# EAGLE design Tiny PowerSpy (EAGLE 9.6.2)
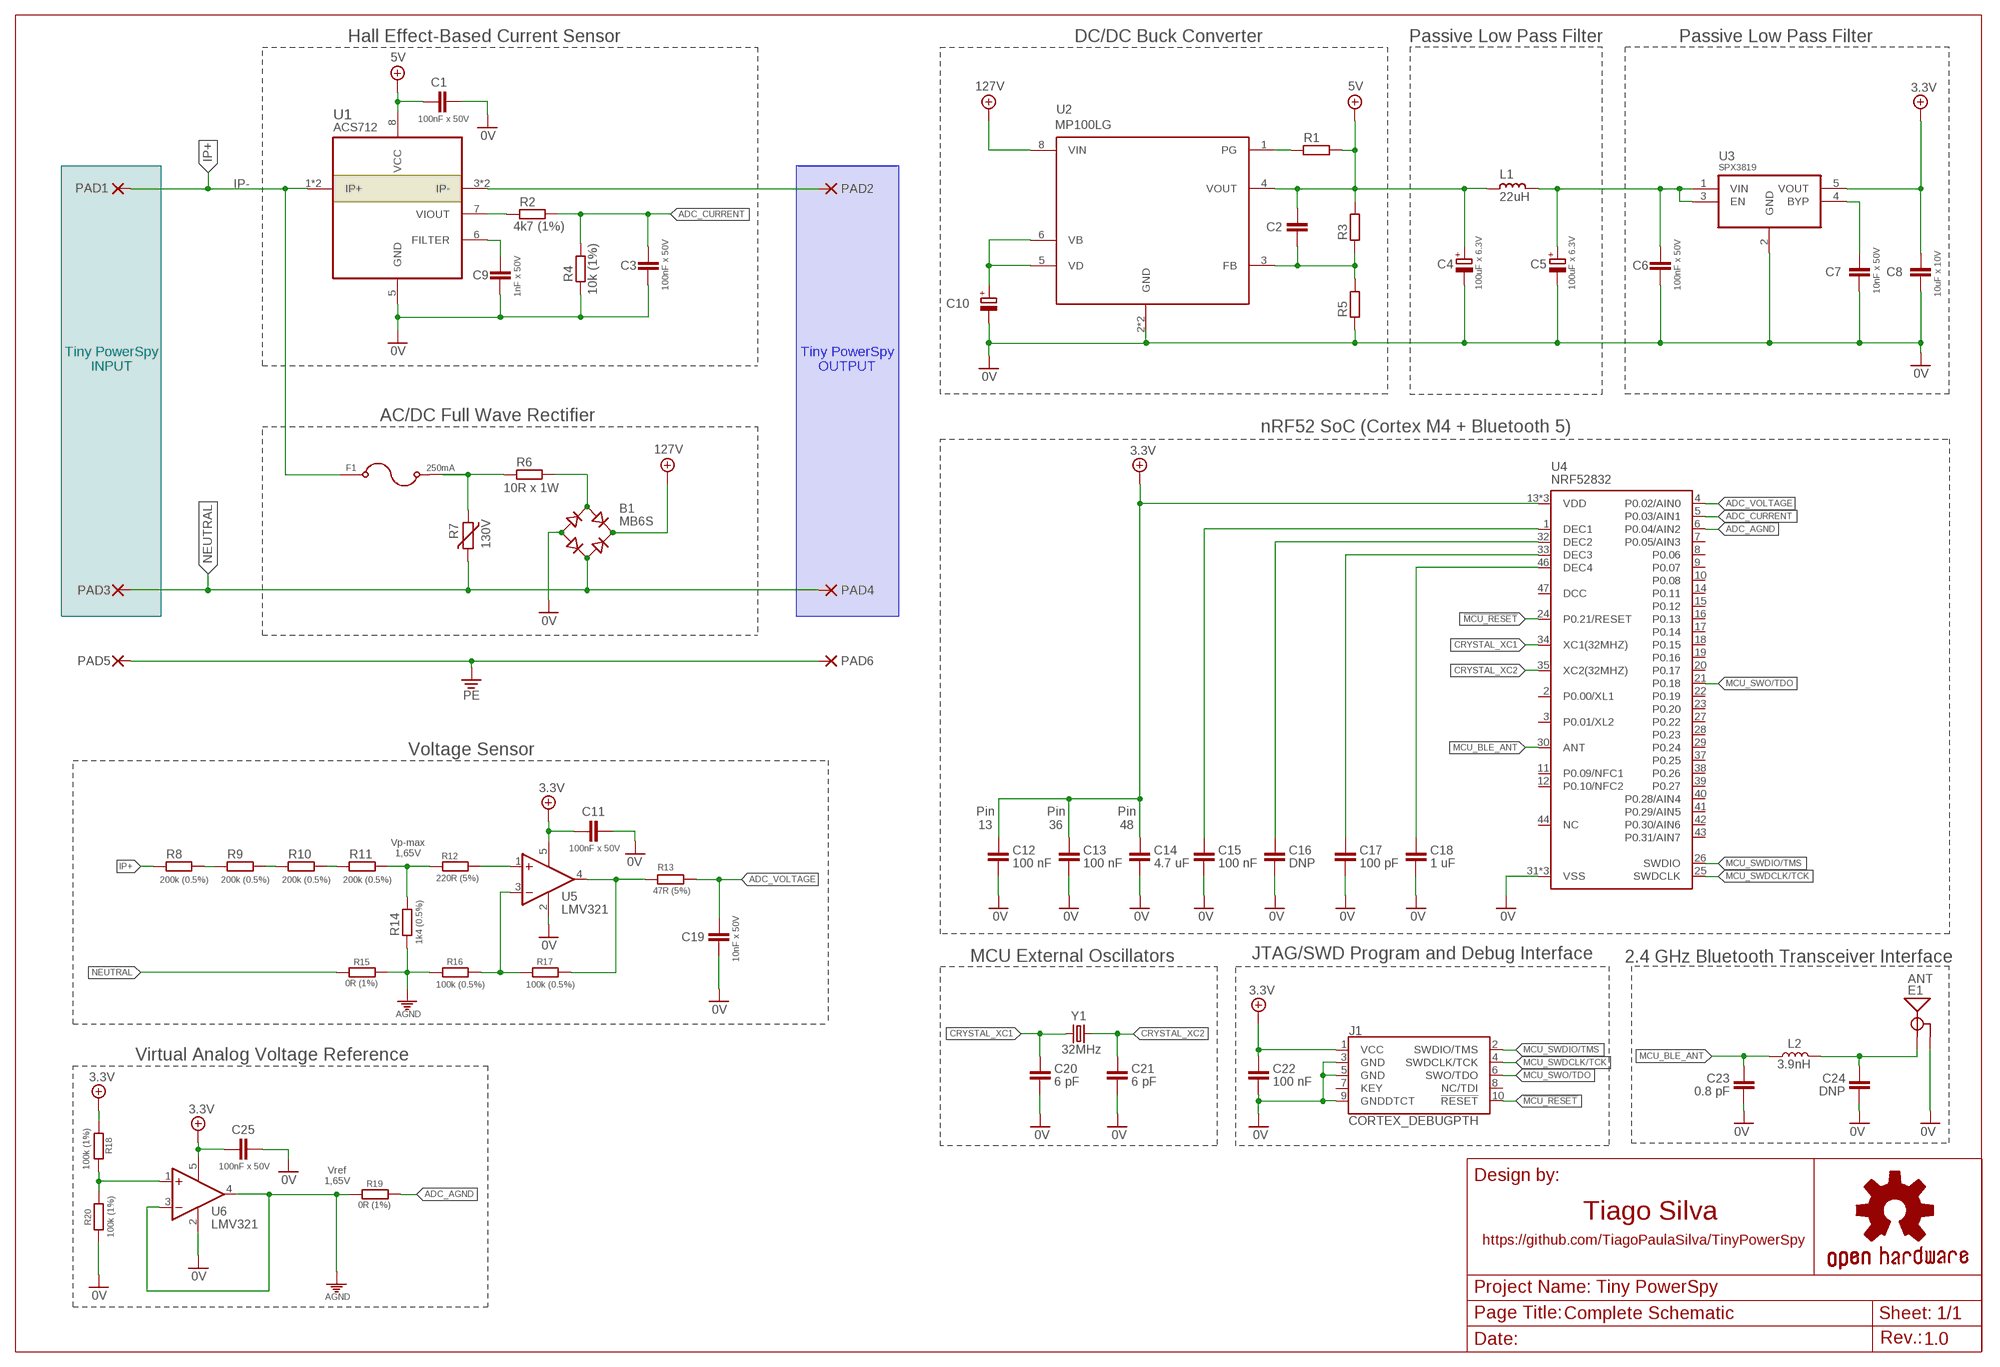
[diagram p0: schematic, sheet 1]

## Parts
B1  MB6S  [SOIC-4]
C1  100nF x 50V  C-EUC0603  [C0603]
C2  C-EUC0603  [C0603]
C3  100nF x 50V  C-EUC0603  [C0603]
C4  100uF x 6.3V  C-USC1206K  [C1206K]
C5  100uF x 6.3V  C-USC1206K  [C1206K]
C6  100nF x 50V  C-EUC0603  [C0603]
C7  10nF x 50V  C-EUC0603  [C0603]
C8  10uF x 10V  C-EUC0603  [C0603]
C9  1nF x 50V  C-EUC0603  [C0603]
C10  CPOL-EUE3.5-8  [E3,5-8]
C11  100nF x 50V  C-EUC0603  [C0603]
C12  100 nF  C-EUC0402  [C0402]
C13  100 nF  C-EUC0402  [C0402]
C14  4.7 uF  C-EUC0603  [C0603]
C15  100 nF  C-EUC0402  [C0402]
C16  DNP  C-EUC0402  [C0402]
C17  100 pF  C-EUC0402  [C0402]
C18  1 uF  C-EUC0603  [C0603]
C19  10nF x 50V  C-EUC0603  [C0603]
C20  6 pF  C-EUC0402  [C0402]
C21  6 pF  C-EUC0402  [C0402]
C22  100 nF  C-EUC0603  [C0603]
C23  0.8 pF  C-EUC0603  [C0603]
C24  DNP  C-EUC0603  [C0603]
C25  100nF x 50V  C-EUC0603  [C0603]
E1  ANT  ANTENNA-GROUNDEDTRACE-15.2MM  [TRACE_ANTENNA_2.4GHZ_15.2MM]
F1  250mA  0154004.DR  [FUSE_0154004.DR]
J1  CORTEX_DEBUGPTH  [2X5-PTH-1.27MM]
L1  22uH  L_0603  [L0603]
L2  3.9nH  INDUCTOR-0402-3.9NH  [0402]
PAD1  SMD5  [SMD2,54-5,08]
PAD2  SMD5  [SMD2,54-5,08]
PAD3  SMD2  [SMD1,27-2,54]
PAD4  SMD5  [SMD2,54-5,08]
PAD5  SMD2  [SMD1,27-2,54]
PAD6  SMD5  [SMD2,54-5,08]
R1  R-EU_R0603  [R0603]
R2  4k7 (1%)  R-EU_R0603  [R0603]
R3  R-EU_R0603  [R0603]
R4  10k (1%)  R-EU_R0603  [R0603]
R5  R-EU_R0603  [R0603]
R6  10R x 1W  R-EU_0207/5V  [0207/5V]
R7  130V  VARISTOR  [S05K11]
R8  200k (0.5%)  R-EU_R0603  [R0603]
R9  200k (0.5%)  R-EU_R0603  [R0603]
R10  200k (0.5%)  R-EU_R0603  [R0603]
R11  200k (0.5%)  R-EU_R0603  [R0603]
R12  220R (5%)  R-EU_R0603  [R0603]
R13  47R (5%)  R-EU_R0603  [R0603]
R14  1k4 (0.5%)  R-EU_R0603  [R0603]
R15  0R (1%)  R-EU_R0603  [R0603]
R16  100k (0.5%)  R-EU_R0603  [R0603]
R17  100k (0.5%)  R-EU_R0603  [R0603]
R18  100k (1%)  R-EU_R0603  [R0603]
R19  0R (1%)  R-EU_R0603  [R0603]
R20  100k (1%)  R-EU_R0603  [R0603]
U1  ACS712  ACS712ELCTR-20A-T  [SOIC127P600X175-8N]
U2  MP100LG  [SOIC8E]
U3  SPX3819  SPX3819M5-L-3-3  [SOT95P280X145-5N]
U4  NRF52832  [QFN48-6X6MM]
U5  LMV321  LMV321M5  [SOT23-5]
U6  LMV321  LMV321M5  [SOT23-5]
Y1  32MHz  CRYSTAL-32MHZ-SMD-2.0X1.6MM  [CRYSTAL-SMD-2.0X1.6MM]

## Nets
0V: B1.- C1.1 C3.2 C4.2 C5.2 C6.2 C7.2 C8.2 C9.2 C10.- C11.1 C12.2 C13.2 C14.2 C15.2 C16.2 C17.2 C18.2 C19.2 C20.2 C21.2 C22.2 C23.2 C24.2 C25.2 E1.GND J1.3(GND) J1.5(GND) J1.9(GNDDTCT) R4.2 R5.1 R20.2 U1.5(GND) U2.2(GND) U2.9(GND) U3.2(GND) U4.31(VSS) U4.45(VSS) U4.EP(VSS) U5.2(V-) U6.2(V-)
3.3V: C8.1 C11.2 C12.1 C13.1 C14.1 C22.1 C25.1 J1.1(VCC) R18.2 U3.5(VOUT) U4.13(VDD) U4.36(VDD) U4.48(VDD) U5.5(V+) U6.5(V+)
5V: C1.2 C2.1 C4.1 L1.2 R1.2 R3.2 U1.8(VCC) U2.4(VOUT)
127V: B1.+ U2.8(VIN)
!MCU_RESET!: J1.10(!RESET) U4.24(P0.21/RESET)
ADC_AGND: R19.2 U4.6(P0.04/AIN2)
ADC_CURRENT: C3.1 R2.2 R4.1 U4.5(P0.03/AIN1)
ADC_VOLTAGE: C19.1 R13.1 U4.4(P0.02/AIN0)
AGND: R14.2 R15.2 R16.2 R19.1 U6.3(-IN) U6.4(OUT)
CRYSTAL_XC1: C20.1 U4.34(XC1(32MHZ)) Y1.3
CRYSTAL_XC2: C21.1 U4.35(XC2(32MHZ)) Y1.1
IP+: F1.1 PAD1.1(P) R8.1 U1.1(IP+) U1.2(IP+)
IP-: PAD2.1(P) U1.3(IP-) U1.4(IP-)
MCU_BLE_ANT: C23.1 L2.2 U4.30(ANT)
MCU_SWDCLK/TCK: J1.4(SWDCLK/TCK) U4.25(SWDCLK)
MCU_SWDIO/TMS: J1.2(SWDIO/TMS) U4.26(SWDIO)
MCU_SWO/TDO: J1.6(SWO/TDO) U4.21(P0.18)
N$1: R1.1 U2.1(PG)
N$2: F1.2 R6.1 R7.1
N$3: C16.1 U4.32(DEC2)
N$4: C2.2 R3.1 R5.2 U2.3(FB)
N$5: C10.+ U2.5(VD) U2.6(VB)
N$6: C9.1 U1.6(FILTER)
N$7: B1.~1(AC1) R6.2
N$8: C15.1 U4.1(DEC1)
N$9: C18.1 U4.46(DEC4)
N$10: R2.1 U1.7(VIOUT)
N$11: C24.1 E1.ANT(SIGNAL) L2.1
N$12: R9.2 R10.1
N$13: C17.1 U4.33(DEC3)
N$14: R10.2 R11.1
N$15: R13.2 R17.1 U5.4(OUT)
N$16: C5.1 C6.1 L1.1 U3.1(VIN) U3.3(EN)
N$19: R8.2 R9.1
N$20: C7.1 U3.4(BYP)
N$30: R16.1 R17.2 U5.3(-IN)
N$31: R11.2 R12.2 R14.1
N$32: R12.1 U5.1(+IN)
N$76: R18.1 R20.1 U6.1(+IN)
NEUTRAL: B1.~2(AC2) PAD3.1(P) PAD4.1(P) R7.2 R15.1
PE: PAD5.1(P) PAD6.1(P)
Unconnected: J1.7(KEY) J1.8(NC/TDI) U4.2(P0.00/XL1) U4.3(P0.01/XL2) U4.7(P0.05/AIN3) U4.8(P0.06) U4.9(P0.07) U4.10(P0.08) U4.11(P0.09/NFC1) U4.12(P0.10/NFC2) U4.14(P0.11) U4.15(P0.12) U4.16(P0.13) U4.17(P0.14) U4.18(P0.15) U4.19(P0.16) U4.20(P0.17) U4.22(P0.19) U4.23(P0.20) U4.27(P0.22) U4.28(P0.23) U4.29(P0.24) U4.37(P0.25) U4.38(P0.26) U4.39(P0.27) U4.40(P0.28/AIN4) U4.41(P0.29/AIN5) U4.42(P0.30/AIN6) U4.43(P0.31/AIN7) U4.44(NC) U4.47(DCC)

## Notes on the sheet
- Hall Effect-Based Current Sensor | DC/DC Buck Converter | Passive Low Pass Filter | Passive Low Pass Filter
- Tiny PowerSpy
  INPUT
- Tiny PowerSpy
  OUTPUT
- AC/DC Full Wave Rectifier
- nRF52 SoC (Cortex M4 + Bluetooth 5)
- Voltage Sensor
- Pin
  13
- Pin
  36
- Pin
  48
- Vp-max
  1,65V
- MCU External Oscillators | JTAG/SWD Program and Debug Interface | 2.4 GHz Bluetooth Transceiver Interface
- Virtual Analog Voltage Reference
- Vref
  1,65V
- Tiago Silva
- https://github.com/TiagoPaulaSilva/TinyPowerSpy
- Complete Schematic
- 1.0

## Library data of the parts
B1 = rectifier:MB*S: Bridge Rectifier Source: http://www.fairchildsemi.com/ds/MB/MB6S.pdf
C1 C3 C6 C9 C11 C25 = rcl:C-EU: CAPACITOR, European symbol; PN: C0603C104M5RACTU; SPICEPREFIX: C
C2 C12-C18 C20-C24 = rcl:C-EU: CAPACITOR, European symbol; SPICEPREFIX: C
C4 C5 = rcl:C-US: CAPACITOR, American symbol; SPICEPREFIX: C
C7 C19 = rcl:C-EU: CAPACITOR, European symbol; PN: C0603C103M5RACTU; SPICEPREFIX: C
C8 = rcl:C-EU: CAPACITOR, European symbol; PN: GRM188R61A106ME69D; SPICEPREFIX: C
C10 = rcl:CPOL-EU: POLARIZED CAPACITOR, European symbol; SPICEPREFIX: C
E1 = SparkFun-RF:ANTENNA-GROUNDED: Antenna w/ Ground Connection 2.4GHz antennae with signal and ground terminals. TRACE_ANTENNA_2.4GHZ_15.2MM - Meander Trace antenna 15.2 x 5.7mm footprint Based on layout from TI app note AN043 <http://www.ti.com/lit/an/swra117d/swra117d.pdf>. TRACE_ANTENNA_2.4GHZ_25.7MM - Inverted F trace antenna 25.7 x 7.5 mm footprint. Based on layout from TI design note DN0007 <http://www.ti.com/lit/an/swru120b/swru120b.pdf>.
F1 = Fuse SMD:0154004.DR: 154/154T/154L/154TL Series OMNI-BLOK® Fuse and Holder Assembly; DESCRIPTION: 4A 125V AC 125V DC Fuse Board Mount (Cartridge Style Excluded) Holder, Surface Mount 2-SMD, Square End Block with Holder; DIGI-KEY_PART_NUMBER: F1227CT-ND; MF: Littelfuse Inc.; MP: 0154004.DR; PACKAGE: SMD-2 Littelfuse
J1 = SparkFun-Connectors:CORTEX_DEBUG: Cortex Debug Connector Datasheet <http://infocenter.arm.com/help/topic/com.arm.doc.faqs/attached/13634/cortex_debug_connectors.pdf>
L1 = rc-master-smd:L_: INDUCTOR
L2 = nrf52832-breakout-temp:INDUCTOR: Inductors Resist changes in electrical current. Basically a coil of wire. SparkFun Products: SparkFun Load Cell Amplifier - HX711 <https://www.sparkfun.com/products/13879> IOIO-OTG - V2.2 <https://www.sparkfun.com/products/13613>; PROD_ID: NDUC-13457
PAD1 PAD2 PAD4 PAD6 = Wirepad:SMD5: SMD PAD
PAD3 PAD5 = Wirepad:SMD2: SMD PAD
R1-R5 = rcl:R-EU_: RESISTOR, European symbol; SPICEPREFIX: R
R6 = resistor pot:R-EU_: RESISTOR, European symbol; PN: AC01000008208JACCS; SPICEPREFIX: R
R7 = varistor:VARISTOR
R8-R11 = rcl:R-EU_: RESISTOR, European symbol; PN: RC0603DR-07200KL; SPICEPREFIX: R
R12 = rcl:R-EU_: RESISTOR, European symbol; PN: RC0603JR-07220RL; SPICEPREFIX: R
R13 = rcl:R-EU_: RESISTOR, European symbol; PN: RC0603JR-0747RL; SPICEPREFIX: R
R14 = rcl:R-EU_: RESISTOR, European symbol; PN: ERJ-3RBD1401V; SPICEPREFIX: R
R15 R19 = rcl:R-EU_: RESISTOR, European symbol; PN: AC0603FR-070RL; SPICEPREFIX: R
R16-R18 R20 = rcl:R-EU_: RESISTOR, European symbol; PN: ERJ-3RBD104V; SPICEPREFIX: R
U1 = ACS712:ACS712ELCTR-20A-T; AVAILABILITY: Unavailable; DESCRIPTION: Current Sensor 20A 1 Channel Hall Effect, Open Loop Bidirectional 8-SOIC (0.154, 3.90mm Width); MF: Allegro; MP: ACS712ELCTR-20A-T; PACKAGE: SOIC-8 Allegro MicroSystems LLC; PRICE: None
U2 = MP100LGN-P:MP100LG
U3 = SPX3819M5-L-3-3:SPX3819M5-L-3-3: 500mA, LOW-NOISE LDO VOLTAGE REGULATOR; AVAILABILITY: Unavailable; DESCRIPTION: Linear Voltage Regulator IC 1 Output 500mA SOT-23-5; MF: MaxLinear, Inc.; MP: SPX3819M5-L-3-3; PACKAGE: SOT-23-5 Exar; PN: SPX3819M5-L-3-3/TR; PRICE: None
U4 = nrf52832-breakout-temp:NRF52832: Nordic nRF52832 Bluetooth Smart/ANT/2.4GHz RF SoC The nRF52832 SoC is a powerful, highly flexible ultra-low power multiprotocol SoC ideally suited for Bluetooth® Smart ANT and 2.4GHz ultra low-power wireless applications. The nRF52832 SoC is built around a 32-bit ARM® Cortex™-M4F CPU with 512kB + 64kB RAM. The embedded 2.4GHz transceiver supports Bluetooth Smart, ANT and proprietary 2.4 GHz protocol stack. It is on air compatible with the nRF51 Series, nRF24L and nRF24AP Series products from Nordic Semiconductor. Product Page <https://www.nordicsemi.com/eng/Products/Bluetooth-low-energy2/nRF52832>; PROD_ID: IC-13460
U5 U6 = linear:LMV321?*: General Purpose, Low Voltage, Rail-to-Rail Output Operational Amplifiers Source: http://www.national.com/mpf/LM/LMV321.html http://www.national.com/dt/lmv_qual.pdf
Y1 = nrf52832-breakout-temp:CRYSTAL-32MHZ: 32MHz Crystal Digikey Example <http://www.digikey.com/product-detail/en/murata-electronics-north-america/XRCGB32M000F2P00R0/490-9769-1-ND/4952013> Frequency: 32MHz Frequency Stability: ±20ppm Frequency Tolerance: ±20ppm Load Capacitance: 6pF; PROD_ID: XTAL-13459

## Board
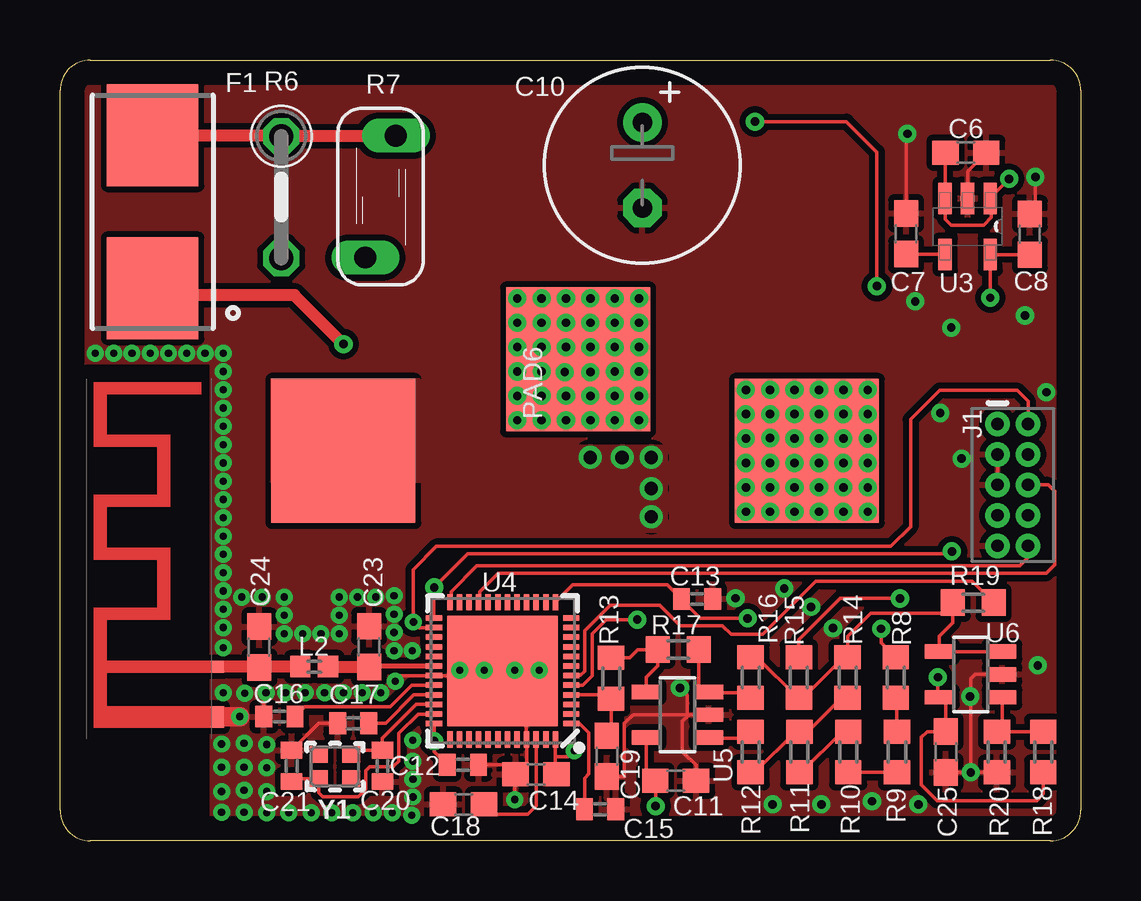
[diagram p1: board, top side]
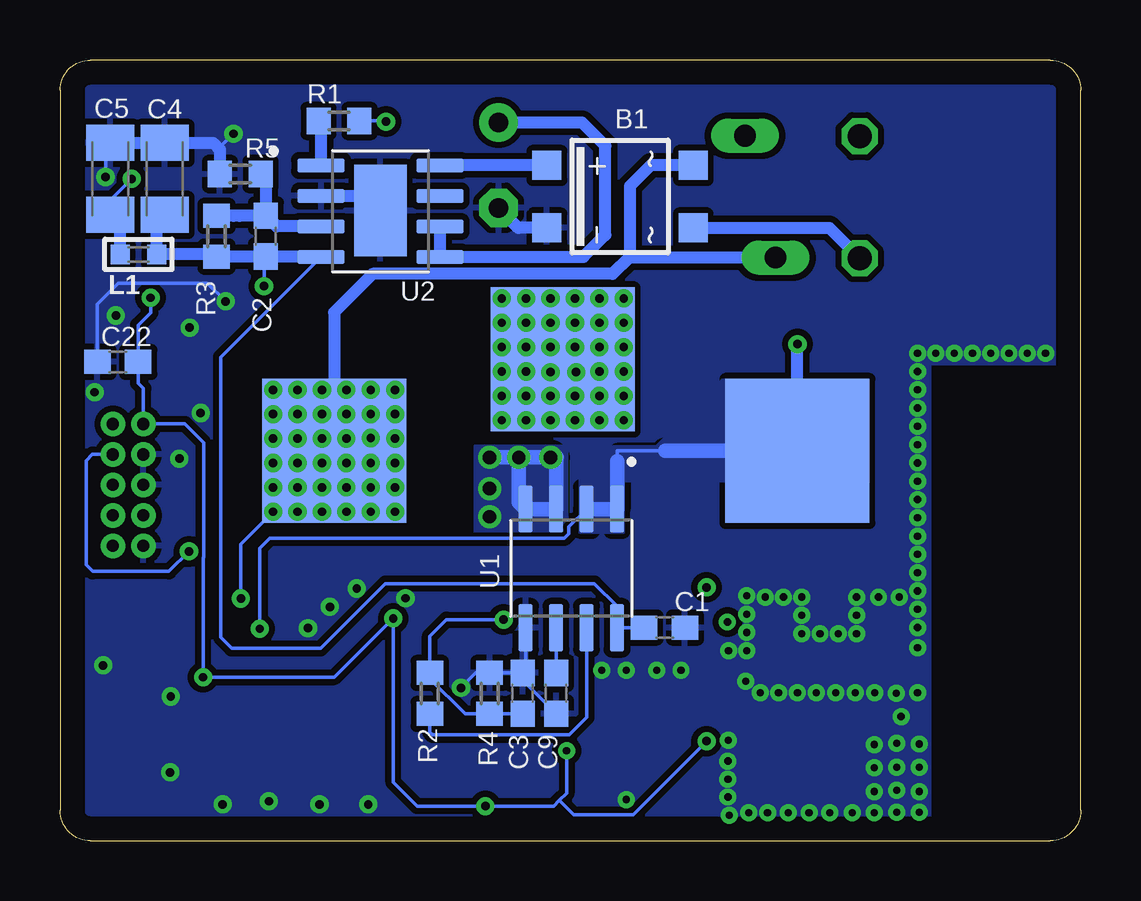
[diagram p2: board, bottom side, seen from below]

Size 42.54 x 32.54 mm. Coordinates in mm from the lower left corner, seen from the top.
Outline: 41.27,0 arc90 42.54,1.27 42.54,31.27 arc90 41.27,32.54 1.27,32.54 arc90 0,31.27 0,1.27 arc90 1.27,0 41.27,0
Copper layers (1*16): Top 0.035mm / dielectric 1.5mm / Bottom 0.035mm
Design rules "default *": minimum track width 6mil, minimum drill 0.3mm, track to track 6mil, track to pad 6mil, pad to pad 6mil, via to via 6mil, smd to smd 6mil, copper to edge 40mil, drill to drill 6mil, minimum pad ring 10mil, minimum via ring 8mil, stop-mask expansion 4mil, vias tented up to drill 14mil, thermal gap 10mil

### Footprints (pad centres in the part's own frame; a part is rotated, then mirrored left to right if it is on the bottom)
SOIC-4 = smd 1.2 x 1.2: + 1.3,3.05; - -1.3,3.05; ~1 -1.3,-3.05; ~2 1.3,-3.05
C0603 = smd 1.1 x 1: 1 -0.85,0; 2 0.85,0
C1206K = smd 1.5 x 2: 1 -1.5,0; 2 1.5,0
E3,5-8 = drill 0.813 pad 1.6: + -1.778,0 | drill 0.813 pad 1.6 octagon: - 1.778,0
C0402 = smd 0.7 x 0.9: 1 -0.65,0; 2 0.65,0
TRACE_ANTENNA_2.4GHZ_15.2MM = smd 0.5 x 0.5: ANT 0,-0.25 | smd 0.9 x 0.5: GND -2.1,-0.25
FUSE_0154004.DR = smd 4.24 x 3.81: 1 -3.19,0; 2 3.19,0
2X5-PTH-1.27MM = drill 0.508 pad 1: 1 -2.54,-0.635; 2 -2.54,0.635; 3 -1.27,-0.635; 4 -1.27,0.635; 5 0,-0.635; 6 0,0.635; 7 1.27,-0.635; 8 1.27,0.635; 9 2.54,-0.635; 10 2.54,0.635
L0603 = smd 0.8 x 0.8: 1 -0.762,0; 2 0.762,0
0402 = smd 0.85 x 0.9: 1 -0.58,0; 2 0.58,0
SMD2,54-5,08 = smd 6 x 6: 1 0,0
SMD1,27-2,54 = smd 6 x 6: 1 0,0
R0603 = smd 1 x 1.1: 1 -0.85,0; 2 0.85,0
0207/5V = drill 1 octagon: 1 -2.54,0; 2 2.54,0
S05K11 = drill 0.914 long: 1 -0.635,-2.54; 2 0.635,2.54
SOIC127P600X175-8N = smd 1.97 x 0.6: 1 -2.475,1.905; 2 -2.475,0.635; 3 -2.475,-0.635; 4 -2.475,-1.905; 5 2.475,-1.905; 6 2.475,-0.635; 7 2.475,0.635; 8 2.475,1.905
SOIC8E = smd 1.97 x 0.6: 1 -2.475,1.905; 2 -2.475,0.635; 3 -2.475,-0.635; 4 -2.475,-1.905; 5 2.475,-1.905; 6 2.475,-0.635; 7 2.475,0.635; 8 2.475,1.905 | smd 2.2 x 3.8: 9 0,0.025
SOT95P280X145-5N = smd 1.321 x 0.559: 1 -1.168,0.94; 2 -1.168,0; 3 -1.168,-0.94; 4 1.168,-0.94; 5 1.168,0.94
QFN48-6X6MM = smd 0.68 x 0.23: 1 -2.86,2.2; 2 -2.86,1.8; 3 -2.86,1.4; 4 -2.86,1; 5 -2.86,0.6; 6 -2.86,0.2; 7 -2.86,-0.2; 8 -2.86,-0.6; 9 -2.86,-1; 10 -2.86,-1.4; 11 -2.86,-1.8; 12 -2.86,-2.2; 25 2.86,-2.2; 26 2.86,-1.8; 27 2.86,-1.4; 28 2.86,-1; 29 2.86,-0.6; 30 2.86,-0.2; 31 2.86,0.2; 32 2.86,0.6; 33 2.86,1; 34 2.86,1.4; 35 2.86,1.8; 36 2.86,2.2 | smd 0.23 x 0.68: 13 -2.2,-2.86; 14 -1.8,-2.86; 15 -1.4,-2.86; 16 -1,-2.86; 17 -0.6,-2.86; 18 -0.2,-2.86; 19 0.2,-2.86; 20 0.6,-2.86; 21 1,-2.86; 22 1.4,-2.86; 23 1.8,-2.86; 24 2.2,-2.86; 37 2.2,2.86; 38 1.8,2.86; 39 1.4,2.86; 40 1,2.86; 41 0.6,2.86; 42 0.2,2.86; 43 -0.2,2.86; 44 -0.6,2.86; 45 -1,2.86; 46 -1.4,2.86; 47 -1.8,2.86; 48 -2.2,2.86 | smd 4.6 x 4.6: EP 0,0
SOT23-5 = smd 0.6 x 1.2: 1 -0.95,-1.306; 2 0,-1.306; 3 0.95,-1.306; 4 0.95,1.306; 5 -0.95,1.306
CRYSTAL-SMD-2.0X1.6MM = smd 0.75 x 0.7: 1 -0.675,-0.5; 2 0.675,-0.5; 3 0.675,0.5; 4 -0.675,0.5

### Placement (x,y rotation side)
B1  19.2,26.85 90 bottom
C1  17.35,8.89 180 bottom
C2  33.96,25.2 90 bottom
C3  23.27,6.15 90 bottom
C4  38.18,27.58 90 bottom
C5  40.44,27.58 90 bottom
C6  37.74,28.68 0 top
C7  35.26,25.3 90 top
C8  40.41,25.27 90 top
C9  21.87,6.15 270 bottom
C10  24.26,28.15 270 top
C11  25.65,2.51 180 top
C12  16.79,3.17 0 top
C13  26.54,10.08 0 top
C14  19.84,2.77 180 top
C15  22.5,1.32 0 top
C16  9.14,5.18 180 top
C17  12.22,4.9 180 top
C18  16.81,1.52 180 top
C19  22.78,3.53 270 top
C20  13.44,3.12 270 top
C21  9.65,3.12 90 top
C22  40.13,19.96 180 bottom
C23  12.88,8.09 90 top
C24  8.31,8.08 90 top
C25  36.91,3.71 270 top
E1  6.32,7.26 90 top
F1  3.86,26.21 90 top
J1  39.7,14.83 270 top
L1  39.27,24.43 0 bottom
L2  10.59,7.26 0 top
PAD1  11.81,16.26 0 bottom
PAD2  11.81,16.26 0 top
PAD3  31.11,16.26 0 bottom
PAD4  31.11,16.26 0 top
PAD5  21.59,20.07 0 bottom
PAD6  21.59,20.07 0 top
R1  30.91,30 0 bottom
R2  27.13,6.15 90 bottom
R3  36.02,25.2 270 bottom
R4  24.64,6.15 90 bottom
R5  35.03,27.79 0 bottom
R6  9.22,26.82 270 top
R7  13.36,26.85 180 top
R8  34.82,6.81 270 top
R9  34.87,3.71 270 top
R10  32.84,3.71 90 top
R11  30.81,3.71 90 top
R12  28.78,3.71 270 top
R13  22.96,6.78 90 top
R14  32.82,6.81 90 top
R15  30.78,6.81 270 top
R16  28.78,6.81 90 top
R17  25.76,7.98 0 top
R18  40.97,3.71 270 top
R19  38.05,9.93 0 top
R20  39.04,3.71 270 top
U1  21.23,11.35 270 bottom
U2  29.18,26.24 0 bottom
U3  37.82,25.6 270 top
U4  18.44,7.09 180 top
U5  25.73,5.26 90 top
U6  37.95,6.93 90 top
Y1  11.46,3.1 0 top

### Tracks (layer width: path | path; a pad name or v marks a point on that pad's centre or on a via)
0V  (via drill 0.3 pad 0.6, 0.35)
  Top 0.152: C11.1 26.5,3.15 25.93,3.72 25.93,4.98 26.21,5.26 U5.2 26.14,5.26 | 26.14,5.26 23.88,5.26 23.52,4.9 23.52,2.69 23.51,2.68 C19.2 | C14.2 18.58,3.17 C12.2 | C14.2 19.44,3.22 U4.45 19.43,5.96 18.44,6.95 U4.EP 18.16,6.81 17.35,6.81 17.27,6.89 U4.31 14.2,6.89 v13.97,6.66 | C17.2 10.78,4.9 C21.2 | C16.2 8.49,6.08 v8.59,6.17 | v25.83,6.38 26.14,6.07 26.14,5.26 | U3.2 37.82,27.9 C6.2 | C8.2 40.42,26.12 40.64,26.34 v40.64,27.66 40.64,25.9 | C7.2 35.26,29.41 v35.31,29.46 | v37.95,2.86 R20.2 | U6.2 38.12,6.93 37.95,6.76 v37.95,2.86 | C25.2 v37.95,2.86 | J1.3 J1.5 | C14.2 18.95,2.73 v18.95,1.72
  Top 0.813: E1.GND 6.59,5.18 v7.49,5.18
  Bottom 0.152: C3.2 R4.2 25.21,7 v25.83,6.38 | U1.5 23.14,7.12 C3.2 | 21.74,5.17 C9.2 23.27,6.69 C3.2 | C5.2 40.64,28.88 v40.64,27.66 | v35.31,29.46 35.88,28.89 R5.1 | C22.2 40.98,22.37 40.11,23.24 36.4,23.24 v35.64,22.48
  Bottom 0.508: B1.- 23.43,25.55 C10.- | C5.2 C4.2 36.16,29.08 35.88,28.8 R5.1 | U2.2 29.16,26.87 28.96,26.67 28.96,26.49 U2.9
  other vias: 1.47,20.32 2.24,20.32 3,20.32 3.76,20.32 4.52,20.32 5.28,20.32 6.05,20.32 6.81,20.32 6.81,19.56 6.81,18.8 6.81,18.03 6.81,17.27 6.81,16.51 6.81,15.75 6.81,14.99 6.81,14.22 6.81,13.46 6.81,12.7 6.81,11.94 6.81,11.18 6.81,10.41 6.81,9.65 6.81,8.89 6.81,8.05 6.73,3.07 6.73,4.04 8.61,4.01 7.67,3.07 7.67,2.11 9.53,1.17 7.67,1.19 8.61,3.05 8.61,2.06 8.61,1.17 11.33,1.17 12.19,1.17 13.06,1.17 13.84,1.17 7.57,10.16 8.43,10.16 9.35,10.16 9.35,9.4 9.35,8.64 10.11,8.64 10.87,8.64 11.63,8.64 11.63,9.4 11.63,10.16 12.4,10.16 13.16,10.16 14.68,7.92 13.92,7.92 13.92,8.69 13.92,9.45 13.92,10.21 14.71,1.83 14.71,2.57 14.71,3.33 7.7,6.15 6.81,6.17 9.4,6.17 10.21,6.17 11.02,6.17 11.81,6.17 12.6,6.17 13.36,6.17 14.7,4.19 6.73,1.19 6.73,2.06 7.67,4.06 14.66,1.07 10.46,1.17 18.95,7.11 17.68,7.11 16.66,7.11 19.96,7.11 40.21,21.89 28.14,10.11 37.13,21.39 37.57,15.93 36.68,17.83 41.1,18.69 40.74,7.32 37.92,6.02 35.76,1.52 32.21,8.86 31.29,9.75 30.18,10.52 33.83,1.65 31.72,1.52 29.69,1.52
  pour Top (isolate 0.254): 0.03,19.91 6.3,19.91 6.3,-0.03 42.52,-0.03 42.52,32.46 0.03,32.46
  pour Bottom (isolate 0.254): 0.03,19.89 6.3,19.89 6.3,-0.03 42.52,-0.03 42.52,32.46 0.03,32.46
3.3V  (via drill 0.3 pad 0.6, 0.35)
  Top 0.152: U5.5 24.42,2.89 C11.2 24.82,2.5 v24.82,1.45 | U4.36 15.6,4.87 v15.6,4.16 15.6,3.72 C12.1 | U4.48 20.64,3.5 | 20.64,3.5 20.64,2.82 C14.1 | v38.76,22.63 38.76,24.41 | 38.76,24.41 U3.5 | R18.2 40.97,1.96 40.69,1.68 36.55,1.68 35.89,2.34 35.89,4.32 36.13,4.56 C25.1 36.91,5.72 U6.5 36.58,6.05 v36.58,6.82 | 20.64,3.5 21.18,3.5 v21.43,3.76 | v28.65,9.27 v28.64,9.28 26.67,9.28 C13.1 25.31,10.67 21.36,10.67 U4.13 | C8.1 38.77,24.42 38.76,24.41
  Bottom 0.152: C22.1 39.28,21.49 38.76,22.01 v38.76,22.63 | 39.1,19.79 39.1,19.68 39.28,19.86 C22.1 | v21.43,3.76 21.43,1.98 21.73,1.69 | 21.73,1.69 21.96,1.45 v24.82,1.45 27.66,1.45 28.65,2.44 v28.65,9.27 31.1,6.82 v36.58,6.82 36.58,11.79 36.55,11.81 36.55,16.59 37.34,17.37 J1.1 39.06,18.86 39.28,19.07 C22.1 | v15.6,4.16 18.66,1.09 21.13,1.09 21.73,1.69
5V  (via drill 0.35)
  Top 0.152: v28.96,29.97 32.77,29.97 34.04,28.7 v34.04,23.11
  Bottom 0.152: C1.2 19.32,8.89 | 19.32,8.89 U1.8 | R1.2 28.98,30 v28.96,29.97 | v34.04,23.11 34.04,24.27 C2.1 | U2.4 35.84,20.15 35.84,8.48 35.38,8.03 31.67,8.03 28.98,10.72 20.27,10.72 19.32,9.77 19.32,8.89
  Bottom 0.508: U2.4 31.67,24.35 C2.1 R3.2 36.1,24.43 L1.2 38.53,24.46 38.53,25.73 C4.1
127V
  Bottom 0.508: B1.+ U2.8
!MCU_RESET!
  Top 0.152: U4.24 16.3,10 16.3,10.38 17.37,11.46 39.98,11.46 40.34,11.81 J1.10
ADC_AGND
  Top 0.152: U4.6 21.68,6.89 21.87,7.08 21.87,8.76 22.93,9.83 25,9.83 25.85,8.97 27.6,8.97 27.96,8.61 29.29,8.61 31.49,10.81 38.02,10.81 R19.2
ADC_CURRENT  (via drill 0.35)
  Top 0.152: U4.5 21.78,6.49 22.05,6.76 22.1,6.81 22.17,6.88 22.17,8.64 22.76,9.22 v24.05,9.22
  Bottom 0.152: 23.37,5.2 C3.1 R4.1 25.66,5.3 27.13,6.76 R2.2 27.13,8.53 26.44,9.22 v24.05,9.22
ADC_VOLTAGE
  Top 0.152: U4.4 22.81,6.09 R13.1 22.96,4.56 C19.1
AGND
  Top 0.152: R16.2 29.03,7.66 30.73,5.96 R15.2 30.96,5.96 32.66,7.66 R14.2 32.82,8.53 33.78,9.49 36.76,9.49 R19.1 37.2,9.09 36.64,8.54 U6.4 U6.3
CRYSTAL_XC1
  Top 0.152: U4.34 14.85,5.69 13.44,4.27 C20.1 12.31,3.77 Y1.3
CRYSTAL_XC2
  Top 0.152: C21.1 9.78,2.6 Y1.1 10.78,2.01 10.94,1.84 12.43,1.84 12.73,2.15 12.73,2.93 12.9,3.1 13.89,3.1 13.89,3.11 14.12,3.33 14.12,4.48 14.92,5.29 U4.35
IP+  (via drill 0.35)
  Top 0.152: v34.21,8.84 34.21,8.27 R8.1
  Top 0.508: v11.81,20.7 9.77,22.74 4.14,22.74 F1.1
  Bottom 0.152: 17.32,16.26 19.33,16.26 19.33,15.82 | U1.2 21.34,13.09 21.34,12.79 21.52,12.62 33.79,12.62 34.21,12.19 v34.21,8.84
  Bottom 0.508: PAD1.1 v11.81,20.7
  Bottom 0.61: 19.33,15.82 U1.1 U1.2 | 17.32,16.26 14.38,16.26
  pour Bottom (no thermals): 19.05,14.96 19.05,12.83 20.88,12.83 20.88,16.46 17.7,16.46 14.94,19.23 8.84,19.23 8.84,14.96
IP-  (via drill 0.55)
  Bottom 0.61: v23.42,15.98 23.42,14.11 U1.4 U1.3 21.87,15.95 21.84,15.98 v22.1,15.98 v23.42,15.98 | v24.64,15.98 v23.42,15.98
  other vias: 24.64,14.68 24.64,13.51
  pour Bottom (no thermals): 21.39,12.88 21.39,16.46 25.27,16.46 25.27,12.88
  pour Top (no thermals): 21.39,14.96 21.39,12.88 25.3,12.88 25.3,16.46 17.75,16.46 14.99,19.23 8.79,19.23 8.79,14.96
MCU_BLE_ANT
  Top 0.203: U4.30 12.92,7.29 arc90 C23.1
  Top 0.5: C23.1 11.19,7.24 L2.2
MCU_SWDCLK/TCK  (via drill 0.35)
  Top 0.152: U4.25 15.58,10.55 v15.6,10.57 16.99,11.96 37.06,11.96 v37.16,12.06
  Bottom 0.152: v37.16,12.06 38,11.23 41.17,11.23 41.45,11.5 41.45,15.85 41.19,16.1 J1.4
MCU_SWDIO/TMS  (via drill 0.3 pad 0.6)
  Top 0.152: U4.26 14.96,8.89 v14.73,9.12 14.73,11.31 15.69,12.27 34.62,12.27 35.45,13.09 35.45,17.56 36.65,18.77 39.88,18.77 40.34,18.31 J1.2
MCU_SWO/TDO
  Top 0.152: U4.21 17.5,10 17.5,10.38 18.27,11.15 41.09,11.15 41.45,11.51 41.45,14.56 41.17,14.83 J1.6
N$1
  Bottom 0.508: U2.1 31.66,29.89 R1.1
N$2
  Top 0.508: F1.2 9.18,29.4 R6.1 13.97,29.36 R7.1
N$3
  Top 0.152: U4.32 14.66,6.49 13.77,5.59 10.2,5.59 C16.1
N$4
  Bottom 0.508: R5.2 33.96,27.57 C2.2 | C2.2 35.05,26.05 | 35.05,26.05 35.31,26.05 | 35.31,26.05 R3.1 | U2.3 33.52,25.6 C2.2 | 35.05,26.05 | 35.31,26.05
N$5
  Bottom 0.508: C10.+ 20.79,29.93 19.81,28.96 19.81,25.25 20.73,24.33 U2.5 U2.6
N$6
  Bottom 0.152: C9.1 U1.6
N$7
  Bottom 0.508: B1.~1 10.49,25.55 R6.2
N$8
  Top 0.152: U4.1 21.66,4.89 22.04,4.51 22.04,2.8 21.85,2.62 C15.1
N$9
  Top 0.152: U4.46 19.84,1.46 19.5,1.12 18.07,1.12 C18.1
N$10
  Bottom 0.152: U1.7 20.6,5.14 21.33,4.42 27.01,4.42 27.13,4.53 R2.1
N$11
  Top 0.5: L2.1 8.31,7.26 | 8.31,7.26 E1.ANT | C24.1 8.31,7.26
N$12
  Top 0.152: R10.1 R9.2
N$13
  Top 0.152: U4.33 14.75,6.09 13.56,4.9 C17.1
N$14
  Top 0.152: R11.1 30.89,2.86 32.59,4.56 R10.2
N$15
  Top 0.152: R13.2 23.73,7.63 24.07,7.96 24.89,7.96 R17.1 24.91,7.3 24.42,6.82 U5.4
N$16  (via drill 0.35)
  Top 0.152: C6.1 36.88,28.66 U3.3 36.88,25.91 37.13,25.65 38.48,25.65 38.81,25.98 38.81,26.85 | U3.1 38.76,26.8 38.81,26.85 | 38.81,26.85 v39.55,27.58
  Bottom 0.152: v39.55,27.58 40.44,26.7 C5.1
  Bottom 0.508: L1.1 40.03,25.68 C5.1
N$19
  Top 0.152: R8.2 34.87,5.91 R9.1
N$20
  Top 0.152: C7.1 36.87,24.45 U3.4
N$30
  Top 0.152: R17.2 26.61,6.21 U5.3 27.06,6.18 28.55,6.18 R16.1
N$31
  Top 0.152: R12.2 28.96,2.86 30.66,4.56 R11.2 31.17,4.56 32.56,5.96 R14.1
N$32
  Top 0.152: U5.1 27.06,4.28 28.5,4.28 R12.1
N$76
  Top 0.152: R18.1 R20.1 39.25,4.77 U6.1
NEUTRAL  (via drill 0.35)
  Top 0.152: R15.1 30.79,8.38 32.5,10.1 v35,10.1 | v28.57,18.8 v29.59,18.8 v30.61,18.8 | v31.62,18.8 v32.64,18.8 v33.66,18.8 | v31.62,18.8 v30.61,18.8 | v30.61,18.8 30.61,18.39 30.86,18.39 31.11,18.13 31.12,18.13 | PAD4.1 31.04,16.34 31.04,16.18 31.05,16.16 31.18,16.16 31.27,16.26 PAD4.1 | v33.66,13.72 v33.66,14.73 | v28.57,14.73 v28.57,15.75 | v29.59,16.79 v29.59,17.78 | v31.62,17.78 v31.62,18.8 | PAD4.1 v31.62,15.75 | PAD4.1 v30.61,15.75
  Bottom 0.152: 31.11,18.38 31.11,18.13 30.61,18.64 v30.61,18.8 30.36,18.55 30.36,18.38 | PAD4.1 35,12.37 v35,10.1 | PAD4.1 31.04,16.34 | v28.57,17.78 v29.59,17.78 v30.61,17.78 v31.62,17.78 v32.64,17.78 v33.66,17.78 | v28.57,15.75 v29.59,15.75 v30.61,15.75 v31.62,15.75 | v31.62,15.75 v32.64,15.75 v33.66,15.75 | v33.66,16.76 v32.64,16.76 v31.62,16.76 | v31.62,16.76 v30.61,16.76 30.58,16.79 v29.59,16.79 28.6,16.79 v28.57,16.76 | v33.66,14.73 v32.64,14.73 v31.62,14.73 v30.61,14.73 v29.59,14.73 v28.57,14.73 | v28.57,13.72 v29.59,13.72 v30.61,13.72 v31.62,13.72 v32.64,13.72 v33.66,13.72 | v31.62,15.75 v31.62,16.76 | PAD4.1 v31.62,16.76
  Bottom 0.508: R7.2 18.82,24.31 | 30.36,18.38 31.11,18.38 31.11,22.02 29.52,23.62 19.51,23.62 18.82,24.31 | B1.~2 17.93,28.15 18.8,27.28 18.8,24.33 18.82,24.31
PE  (via drill 0.35)
  Top 0.152: v19.05,22.61 v20.07,22.61 | v20.07,22.61 20.07,22.2 | 20.09,21.57 20.09,22.58 v20.07,22.61 | v24.13,22.61 v23.11,22.61 v22.1,22.61 | v24.13,21.59 v23.11,21.59 v22.1,21.59 v21.08,21.59 v20.07,21.59 v19.05,21.59 19.02,21.57 | v19.05,20.57 v20.07,20.57 v21.08,20.57 v22.1,20.57 | v22.1,20.57 v23.11,20.57 v24.13,20.57 | v24.13,19.56 v23.11,19.56 23.09,19.53 v22.1,19.53 21.08,19.53 | 21.08,19.53 v21.03,19.53 | v21.03,19.53 20.09,19.53 v20.07,19.56 v19.05,19.56 | v19.05,18.54 v20.07,18.54 v22.1,18.54 | v22.1,18.54 v24.13,18.54 | v22.1,18.54 v21.08,18.54 21.08,19.53 | v23.11,18.54 v24.13,18.54 | v19.05,17.53 v20.07,17.53 v21.08,17.53 v22.1,17.53 v23.11,17.53 v24.13,17.53 v24.13,18.54 | v22.1,20.57 PAD6.1 21.06,19.53 v21.03,19.53
  Top 0.508: v23.11,22.61 21.59,21.08 v20.07,22.61 | 21.59,22.1 v22.1,22.61 | PAD6.1 21.59,22.1 | 21.59,22.1 v21.08,22.61 | 19.02,21.57 20.09,21.57
  Bottom 0.152: v22.1,19.53 21.59,20.04 PAD6.1 | PAD6.1 v21.08,20.57 | PAD6.1 v22.1,20.57 | PAD6.1 21.57,20.07 v21.03,19.53